# Altium schematic sheet project-schematic.SchDoc
size A4; SheetNumber: 1; SheetTotal: 1
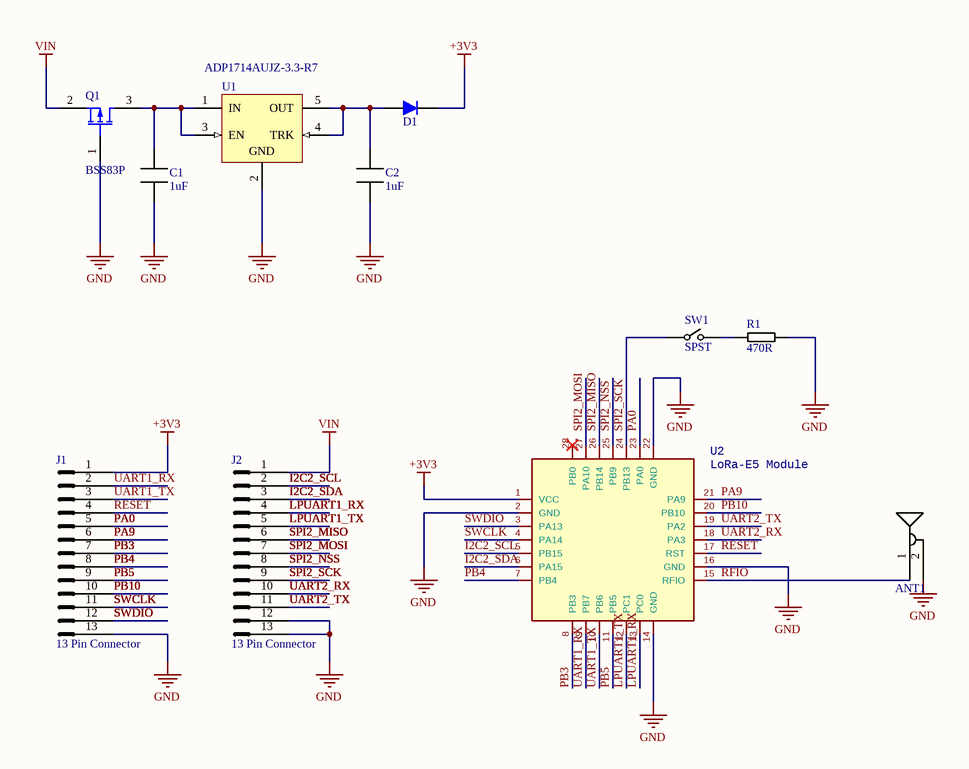
[diagram p0: project-schematic.SchDoc]

## Parts
ANT1  Antenna  [Linx-ANT-915-uSP410]  (value not drawn)
C1  1uF  [CAPACITOR_0603]
C2  1uF  [CAPACITOR_0603]
D1  Schottky Diode  [SODFL350X90-2N]  (value not drawn)
J1  13 Pin Connector  [Connector-Pin-Header-2.54mm-1x13 - duplicate]
J2  13 Pin Connector  [Connector-Pin-Header-2.54mm-1x13 - duplicate]
Q1  BSS83P  [INF-PG-SOT23_N]
R1  470R  [Resistor_0603]
SW1  SPST  [TL3342]
U1  ADP1714AUJZ-3.3-R7  [ADI-UJ-5_M]
U2  LoRa-E5 Module  [LoRa-e5]

## Nets
+3V3: D1.2 J1.1(-) U2.1(VCC)
GND: ANT1.2(-) C1.1 C2.1 J1.13(-) J2.12(-) J2.13(-) Q1.1(G) R1.2 U1.2(GND) U2.2(GND) U2.14(GND) U2.16(GND) U2.22(GND)
VIN: J2.1(-) Q1.2(S)
I2C2_SCL: J2.2(-) U2.5(PB15)
I2C2_SDA: J2.3(-) U2.6(PA15)
LPUART1_RX: J2.4(-) U2.13(PC0)
LPUART1_TX: J2.5(-) U2.12(PC1)
PA0: J1.5(-) U2.23(PA0)
PA9: J1.6(-) U2.21(PA9)
PB3: J1.7(-) U2.8(PB3)
PB4: J1.8(-) U2.7(PB4)
PB5: J1.9(-) U2.11(PB5)
PB10: J1.10(-) U2.20(PB10)
RESET: J1.4(-) U2.17(RST)
RFIO: ANT1.1(-) U2.15(RFIO)
SPI2_MISO: J2.6(-) U2.26(PB14)
SPI2_MOSI: J2.7(-) U2.27(PA10)
SPI2_NSS: J2.8(-) U2.25(PB9)
SPI2_SCK: J2.9(-) SW1.1(-) U2.24(PB13)
SWCLK: J1.11(-) U2.4(PA14)
SWDIO: J1.12(-) U2.3(PA13)
UART1_RX: J1.2(-) U2.9(PB7)
UART1_TX: J1.3(-) U2.10(PB6)
UART2_RX: J2.10(-) U2.18(PA3)
UART2_TX: J2.11(-) U2.19(PA2)
NetC1_2: C1.2 Q1.3(D) U1.1(IN) U1.3(EN)
NetC2_2: C2.2 D1.1 U1.4(TRK) U1.5(OUT)
NetR1_1: R1.1 SW1.2

Not connected (* = marked no-connect by the designer): U2 28(PB0)*

## Library data of the parts
ANT1 = 915 MHz Antenna
C1 C2 = Capacitor: Generic Capacitor
D1 = Diode: Schottky Barrier Diode
J1 J2 = Connector-Male-1x13
Q1 = CMP-1099-00031-1: P-Channel SIPMOS Small-Signal-Transistor, -60 V VDS, -0.33 A ID, -55 to 150 degC, PG-SOT23, Reel, Green; Manufacturer: Infineon; RDS (on) (max): 2,000Â mOhm; VGS(th) (min): -1Â V; VDS (max): -60Â V; VGS(th) (max): -2Â V; IDpuls (max): -1.32Â A; Green: TRUE; ID (max): -0.33Â A; QG: 2.38Â nC; Rth: 350Â K/W; RDS (on) (max) (@4.5V): 3,000Â mOhm; Pto t (max): 0.36Â W; PackageDescription: 3-Pin Small Outline Transistor Package, 2.9 x 1.3 mm Body, 0.95 mm Pitch; ComponentLink1Description: Manufacturer URL; Packing: Reel; Mounting Technology: Surface Mount; ComponentLink1URL: http://www.infineon.com/; PartNumber: BSS83P; ComponentLink3Description: Package Specification; PackageReference: PG-SOT23; Halogen-free: TRUE; ComponentLink3URL: http://www.infineon.com/dgdl/SOT23-Package_Overview.pdf?folderId=db3a30431936bc4b0119532290053c66&fileId=db3a30431936bc4b0119533468123c85; ComponentLink2Description: Datasheet; ComponentLink2URL: http://www.infineon.com/dgdl/BSS83P_Rev1.5.pdf?folderId=db3a3043156fd5730115d6a107c41454&fileId=db3a304330f686060131045ae20e3ea3; PackageVersion: Apr-08; DatasheetVersion: Rev. 1.5
R1 = Resistor: Generic 0603 Resistor
SW1 = SPST Switch: Single Pole Single Throw Switch
U1 = CMP-0786-00382-1: 300 mA, Low Dropout CMOS Linear Regulator, 2.5 to 5.5 V Vin, 3.3 V Vout, Industrial, 5-pin SOT23 (UJ-5), Reel; Manufacturer: Analog Devices; Vin (min) (V): 2.5; Vin (max) (V): 5.5; Preset Vout Values (V): 3.3; Iout max: 300mA; Supply Current IGND @ Small Load: 60uA; Mounting Technology: Surface Mount; ComponentLink4Description: URL Link1; ComponentLink1Description: Manufacturer URL; Code_JEDEC: MO-193-AB; ComponentLink3URL: http:/www.analog.com/static/imported-files/packages/PKG_PDF/TSOT(UJ)/UJ_5.pdf; PackageReference: UJ-5; DatasheetVersion: Rev. A; PackageDescription: 5-Pin Thin Small Outline Transistor Package, Body 2.9 x 1.6 mm, Pitch 0.95 mm; ComponentLink2Description: Datasheet; PartNumber: ADP1714AUJZ-3.3-R7; PackageVersion: 100708-A, 10/2008; ComponentLink3Description: Package Specification; ComponentLink4URL: Product URL:http://www.analog.com/en/ADP1714/productSearch.html; ComponentLink1URL: http://www.analog.com/en/index.html; ComponentLink2URL: http://www.analog.com/static/imported-files/data_sheets/ADP1712_1713_1714.pdf; Packing: Reel
U2 = LoRa-E5: ARM Cortex-M4 and SX126x embedded, supports LoRaWAN on EU868 & US915